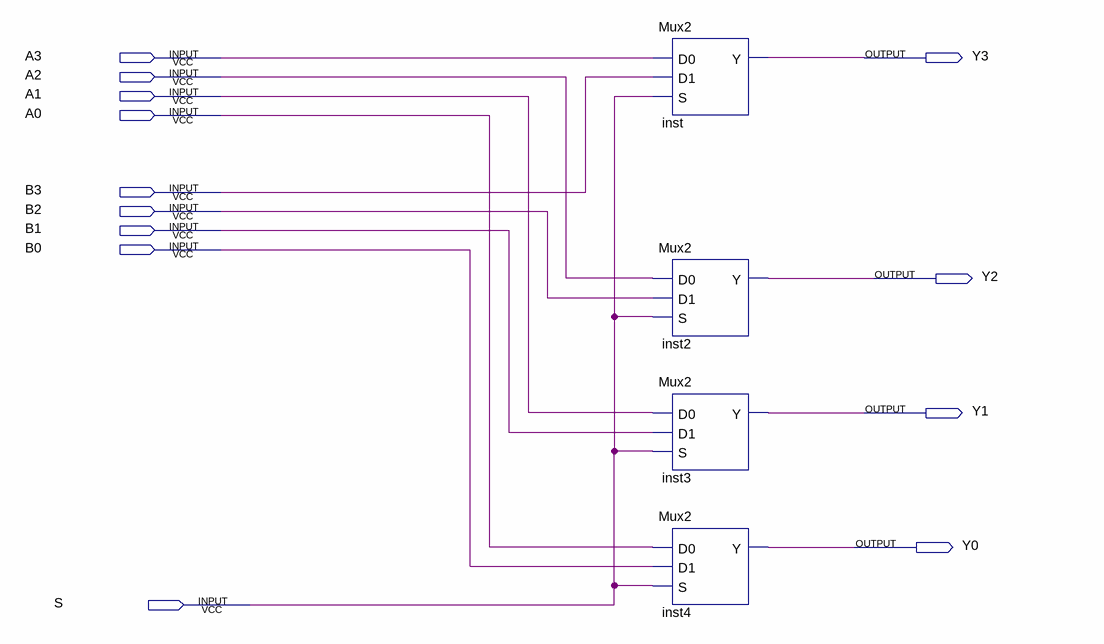
[diagram p0: schematic sheet]
// Quartus schematic Selector.bdf as structural Verilog: 4 symbols, 13 pins
module Selector (
  input  A3,
  input  A2,
  input  A1,
  input  A0,
  input  B3,
  input  B2,
  input  B1,
  input  B0,
  input  S,
  output Y3,
  output Y2,
  output Y1,
  output Y0
);

  Mux2 inst (.D0(A3), .D1(B3), .S(S), .Y(Y3));
  Mux2 inst2 (.D0(A2), .D1(B2), .S(S), .Y(Y2));
  Mux2 inst3 (.D0(A1), .D1(B1), .S(S), .Y(Y1));
  Mux2 inst4 (.D0(A0), .D1(B0), .S(S), .Y(Y0));
endmodule
